# Altium schematic sheet Block Diagram.SchDoc
size B
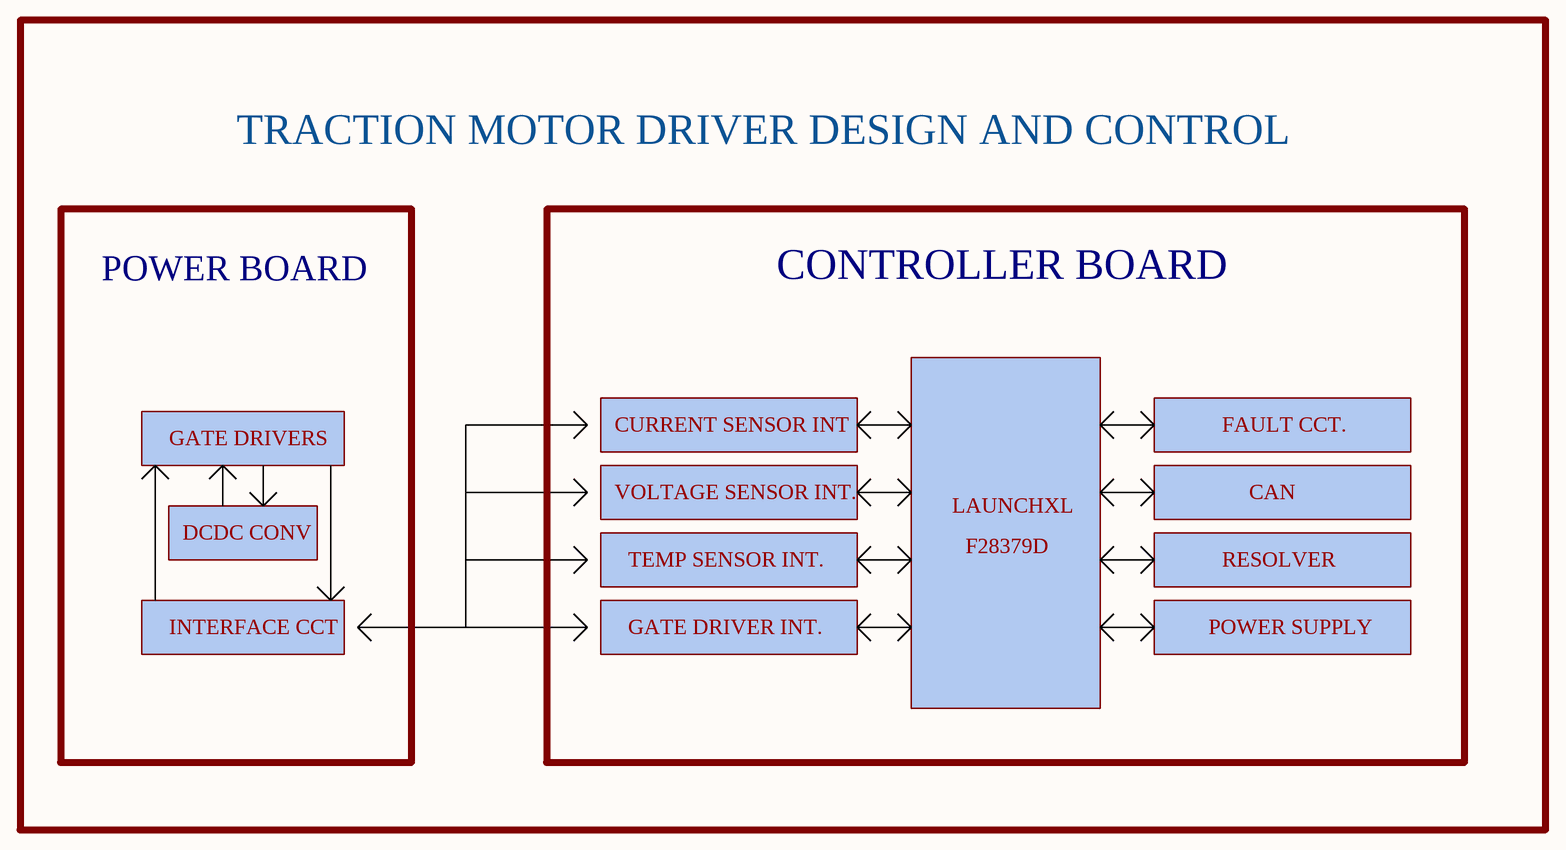
[diagram p0: Block Diagram.SchDoc]

## Notes on the sheet
- TRACTION MOTOR DRIVER DESIGN AND CONTROL
- POWER BOARD
- CONTROLLER BOARD
- GATE DRIVERS
- CURRENT SENSOR INT
- FAULT CCT.
- DCDC CONV
- VOLTAGE SENSOR INT.
- LAUNCHXL
- CAN
- TEMP SENSOR INT.
- F28379D
- RESOLVER
- INTERFACE CCT
- GATE DRIVER INT.
- POWER SUPPLY